# Altium project FC11.PrjPcb
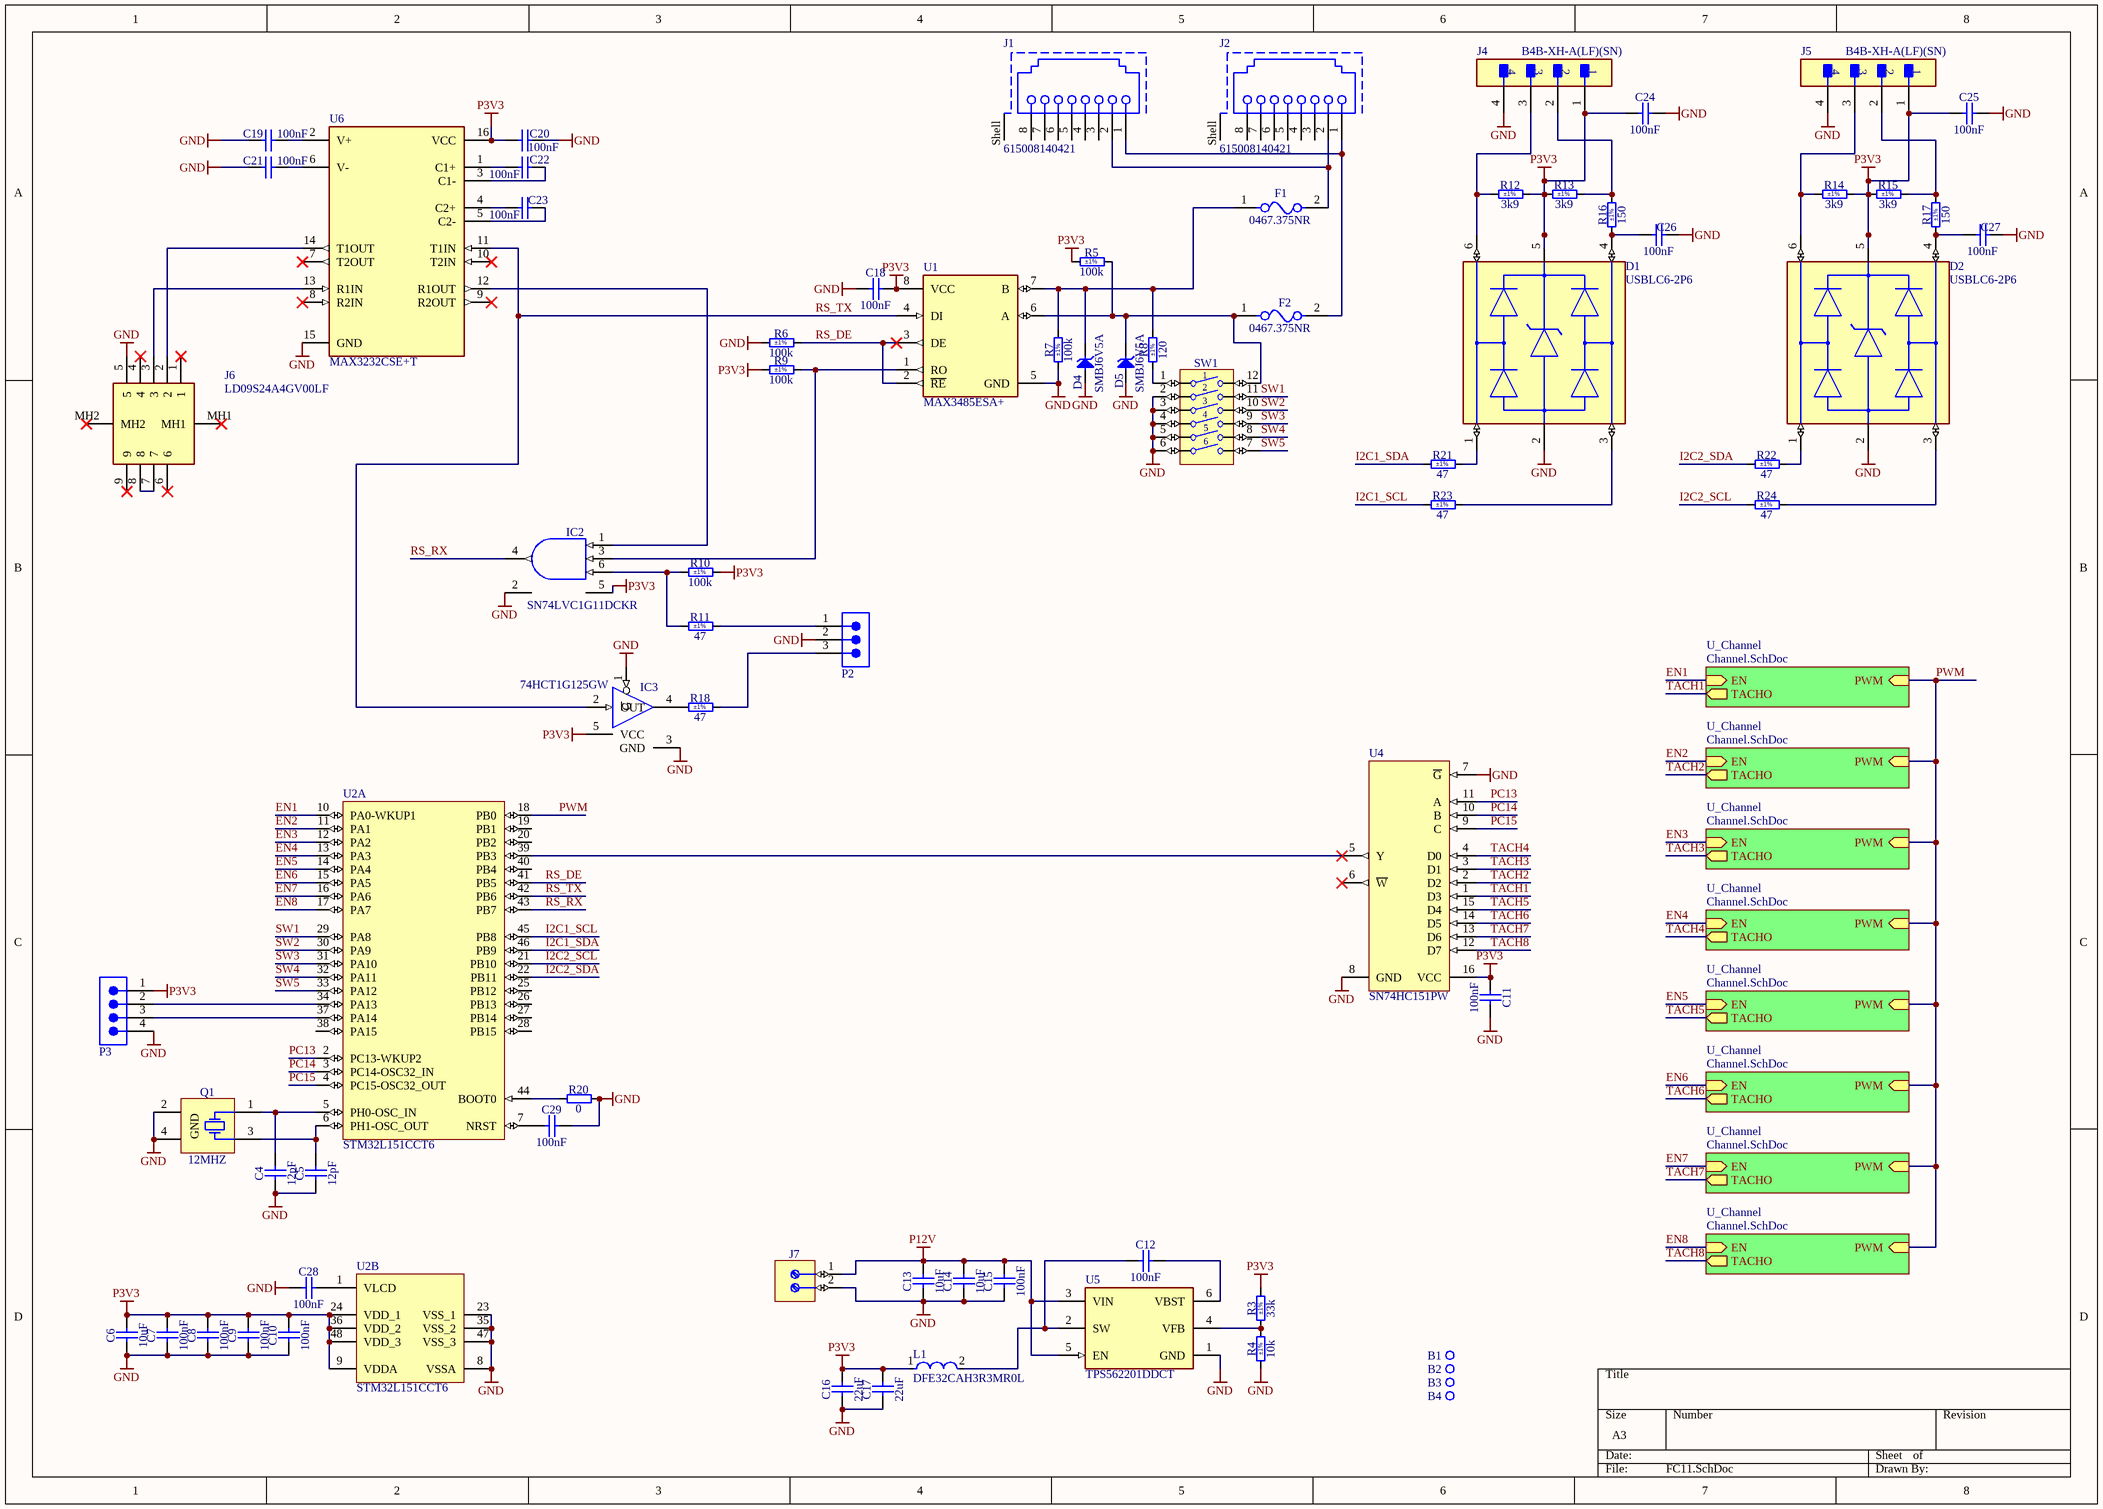
[diagram p0: FC11.SchDoc]
2 sheets, 171 parts. Net scope: hierarchical (ports join the sheet entries above them; power ports are global).
Board file: FC11.PcbDoc
Sheets:
  FC11.SchDoc
    U_Channel = Channel.SchDoc
    U_Channel = Channel.SchDoc
    U_Channel = Channel.SchDoc
    U_Channel = Channel.SchDoc
    U_Channel = Channel.SchDoc
    U_Channel = Channel.SchDoc
    U_Channel = Channel.SchDoc
    U_Channel = Channel.SchDoc

## Sheet FC11.SchDoc
size A3; SheetNumber: 1; SheetTotal: 2

### Parts
B1  Plated Hole  [MTG300_600]  (value not drawn)  (no BOM)
B2  Plated Hole  [MTG300_600]  (value not drawn)  (no BOM)
B3  Plated Hole  [MTG300_600]  (value not drawn)  (no BOM)
B4  Plated Hole  [MTG300_600]  (value not drawn)  (no BOM)
C4  12pF  [CAPC1005X55N]
C5  12pF  [CAPC1005X55N]
C6  10uF  [CAPC2012X95N]
C7  100nF  [CAPC1005X55N]
C8  100nF  [CAPC1005X55N]
C9  100nF  [CAPC1005X55N]
C10  100nF  [CAPC1005X55N]
C11  100nF  [CAPC1005X55N]
C12  100nF  [CAPC1005X55N]
C13  10uF  [CAPC2012X95N]
C14  10uF  [CAPC2012X95N]
C15  100nF  [CAPC1005X55N]
C16  22uF  [CAPC2012X135N]
C17  22uF  [CAPC2012X135N]
C18  100nF  [CAPC1005X55N]
C19  100nF  [CAPC1005X55N]
C20  100nF  [CAPC1005X55N]
C21  100nF  [CAPC1005X55N]
C22  100nF  [CAPC1005X55N]
C23  100nF  [CAPC1005X55N]
C24  100nF  [CAPC1005X55N]
C25  100nF  [CAPC1005X55N]
C26  100nF  [CAPC1005X55N]
C27  100nF  [CAPC1005X55N]
C28  100nF  [CAPC1005X55N]
C29  100nF  [CAPC1005X55N]
D1  USBLC6-2P6  [FP-SOT-666-MFG]
D2  USBLC6-2P6  [FP-SOT-666-MFG]
D4  SMBJ6V5A  [DIOM5336X265N]
D5  SMBJ6V5A  [DIOM5336X265N]
F1  0467.375NR  [FP-467-MFG]
F2  0467.375NR  [FP-467-MFG]
IC2  SN74LVC1G11DCKR  [SOT65P210X110-6N]
IC3  74HCT1G125GW  [SOT65P210X110-5N]
J1  615008140421  [615008140421]
J2  615008140421  [615008140421]
J4  B4B-XH-A(LF)(SN)  [FP-B4B-XH-A_LF_SN-MFG]
J5  B4B-XH-A(LF)(SN)  [FP-B4B-XH-A_LF_SN-MFG]
J6  LD09S24A4GV00LF  [LD09S24A4GV00LF]
J7  (no value)  [PHOENIX_1725656]
L1  DFE32CAH3R3MR0L  [FP-DFE32CAH_R0-MFG]
P2  61300311121  [61300311121]  (value not drawn)
P3  61300411121  [61300411121]  (value not drawn)
Q1  12MHZ  [XTAL_ABRACON_ABM3B]
R3  33k  Tolerance: ±1%  [RESC1005X40N]
R4  10k  Tolerance: ±1%  [RESC1005X40N]
R5  100k  Tolerance: ±1%  [RESC1005X40N]
R6  100k  Tolerance: ±1%  [RESC1005X40N]
R7  100k  Tolerance: ±1%  [RESC1005X40N]
R8  120  Tolerance: ±1%  [RESC1608X55N]
R9  100k  Tolerance: ±1%  [RESC1005X40N]
R10  100k  Tolerance: ±1%  [RESC1005X40N]
R11  47  Tolerance: ±1%  [RESC1005X40N]
R12  3k9  Tolerance: ±1%  [RESC1005X40N]
R13  3k9  Tolerance: ±1%  [RESC1005X40N]
R14  3k9  Tolerance: ±1%  [RESC1005X40N]
R15  3k9  Tolerance: ±1%  [RESC1005X40N]
R16  150  Tolerance: ±1%  [RESC1005X40N]
R17  150  Tolerance: ±1%  [RESC1005X40N]
R18  47  Tolerance: ±1%  [RESC1005X40N]
R20  0  [RESC1005X40N]
R21  47  Tolerance: ±1%  [RESC1005X40N]
R22  47  Tolerance: ±1%  [RESC1005X40N]
R23  47  Tolerance: ±1%  [RESC1005X40N]
R24  47  Tolerance: ±1%  [RESC1005X40N]
SW1  (no value)  [SW_OMRON_A6H-6102]
U1  MAX3485ESA+  [FP-S8-5-MFG]
U2  STM32L151CCT6  [STM-LQFP48_L]  (parts A,B of 2)
U4  SN74HC151PW  [PW0016A_L]
U5  TPS562201DDCT  [FP-DDC0006A-MFG]
U6  MAX3232CSE+T  [FP-S16-1-MFG]

### Sub-sheets
U_Channel = Channel.SchDoc: PWM (in), TACHO (out), EN (in)
U_Channel = Channel.SchDoc: PWM (in), TACHO (out), EN (in)
U_Channel = Channel.SchDoc: PWM (in), TACHO (out), EN (in)
U_Channel = Channel.SchDoc: PWM (in), TACHO (out), EN (in)
U_Channel = Channel.SchDoc: PWM (in), TACHO (out), EN (in)
U_Channel = Channel.SchDoc: PWM (in), TACHO (out), EN (in)
U_Channel = Channel.SchDoc: PWM (in), TACHO (out), EN (in)
U_Channel = Channel.SchDoc: PWM (in), TACHO (out), EN (in)

### Nets
GND: C4.1 C5.1 C6.1 C7.1 C8.1 C9.1 C10.1 C11.1 C13.1 C14.1 C15.1 C16.1 C17.1 C18.1 C19.2 C20.1 C21.2 C24.2 C25.2 C26.2 C27.2 C28.1 C29.2 D1.2(GND) D2.2(GND) D4.2(A) D5.2(A) IC2.2(GND) IC3.1(~{G}) IC3.3(GND) J4.4 J5.4 J6.5 J7.2 P2.2 P3.4 Q1.2(GND) Q1.4(GND) R4.1 R6.1 R7.1 R20.2 SW1.2 SW1.3 SW1.4 SW1.5 SW1.6 U1.5(GND) U2.8(VSSA) U2.23(VSS_1) U2.35(VSS_2) U2.47(VSS_3) U4.7(~{G}) U4.8(GND) U5.1(GND) U6.15(GND)
P3V3: C6.2 C7.2 C8.2 C9.2 C10.2 C11.2 C16.2 C17.2 C18.2 C20.2 C24.1 C25.1 D1.5(VBUS) D2.5(VBUS) IC2.5(VCC) IC3.5(VCC) J4.1 J5.1 L1.1 P3.1 R3.2 R5.1 R9.1 R10.2 R12.2 R13.1 R14.2 R15.1 U1.8(VCC) U2.9(VDDA) U2.24(VDD_1) U2.36(VDD_2) U2.48(VDD_3) U4.16(VCC) U6.16(VCC)
P12V: C13.2 C14.2 C15.2 J7.1 U5.3(VIN) U5.5(EN)
EN1: U2.10(PA0-WKUP1) ; sheet U_Channel/EN
EN2: U2.11(PA1) ; sheet U_Channel/EN
EN3: U2.12(PA2) ; sheet U_Channel/EN
EN4: U2.13(PA3) ; sheet U_Channel/EN
EN5: U2.14(PA4) ; sheet U_Channel/EN
EN6: U2.15(PA5) ; sheet U_Channel/EN
EN7: U2.16(PA6) ; sheet U_Channel/EN
EN8: U2.17(PA7) ; sheet U_Channel/EN
I2C1_SCL: R23.1 U2.45(PB8)
I2C1_SDA: R21.1 U2.46(PB9)
I2C2_SCL: R24.1 U2.21(PB10)
I2C2_SDA: R22.1 U2.22(PB11)
PC13: U2.2(PC13-WKUP2) U4.11(A)
PC14: U2.3(PC14-OSC32_IN) U4.10(B)
PC15: U2.4(PC15-OSC32_OUT) U4.9(C)
PWM: U2.18(PB0) ; sheet U_Channel/PWM, sheet U_Channel/PWM, sheet U_Channel/PWM, sheet U_Channel/PWM, sheet U_Channel/PWM, sheet U_Channel/PWM, sheet U_Channel/PWM, sheet U_Channel/PWM
RS_DE: R6.2 U1.2(~{RE}) U1.3(DE) U2.41(PB5)
RS_RX: IC2.4(Y) U2.43(PB7)
RS_TX: IC3.2(IN) U1.4(DI) U2.42(PB6) U6.11(T1IN)
SW1: SW1.11 U2.29(PA8)
SW2: SW1.10 U2.30(PA9)
SW3: SW1.9 U2.31(PA10)
SW4: SW1.8 U2.32(PA11)
SW5: SW1.7 U2.33(PA12)
TACH1: U4.1(D3) ; sheet U_Channel/TACHO
TACH2: U4.2(D2) ; sheet U_Channel/TACHO
TACH3: U4.3(D1) ; sheet U_Channel/TACHO
TACH4: U4.4(D0) ; sheet U_Channel/TACHO
TACH5: U4.15(D4) ; sheet U_Channel/TACHO
TACH6: U4.14(D5) ; sheet U_Channel/TACHO
TACH7: U4.13(D6) ; sheet U_Channel/TACHO
TACH8: U4.12(D7) ; sheet U_Channel/TACHO
NetC4_2: C4.2 Q1.1(X) U2.5(PH0-OSC_IN)
NetC5_2: C5.2 Q1.3(X) U2.6(PH1-OSC_OUT)
NetC12_1: C12.1 L1.2 U5.2(SW)
NetC12_2: C12.2 U5.6(VBST)
NetC19_1: C19.1 U6.2(V+)
NetC21_1: C21.1 U6.6(V-)
NetC22_1: C22.1 U6.3(C1-)
NetC22_2: C22.2 U6.1(C1+)
NetC23_1: C23.1 U6.5(C2-)
NetC23_2: C23.2 U6.4(C2+)
NetC26_1: C26.1 D1.4(I/O2) R16.1
NetC27_1: C27.1 D2.4(I/O2) R17.1
NetC28_2: C28.2 U2.1(VLCD)
NetC29_1: C29.1 U2.7(NRST)
NetD1_1: D1.1(I/O1) R21.2
NetD1_3: D1.3(I/O2) R23.2
NetD1_6: D1.6(I/O1) J4.3 R12.1
NetD2_1: D2.1(I/O1) R22.2
NetD2_3: D2.3(I/O2) R24.2
NetD2_6: D2.6(I/O1) J5.3 R14.1
NetD4_1: D4.1(C) F1.1 R7.2 R8.2 U1.7(B)
NetD5_1: D5.1(C) F2.1 R5.2 SW1.12 U1.6(A)
NetF1_2: F1.2 J1.2 J2.2
NetF2_2: F2.2 J1.1 J2.1
NetIC2_1: IC2.1(A) U6.12(R1OUT)
NetIC2_3: IC2.3(B) R9.2 U1.1(RO)
NetIC2_6: IC2.6(C) R10.1 R11.1
NetIC3_4: IC3.4(OUT) R18.1
NetJ4_2: J4.2 R13.2 R16.2
NetJ5_2: J5.2 R15.2 R17.2
NetJ6_2: J6.2 U6.14(T1OUT)
NetJ6_3: J6.3 U6.13(R1IN)
NetJ6_7: J6.7 J6.8
NetP2_1: P2.1 R11.2
NetP2_3: P2.3 R18.2
NetP3_2: P3.2 U2.34(PA13)
NetP3_3: P3.3 U2.37(PA14)
NetR3_1: R3.1 R4.2 U5.4(VFB)
NetR8_1: R8.1 SW1.1
NetR20_1: R20.1 U2.44(BOOT0)
NetU2_39: U2.39(PB3) U4.5(Y)

Not connected (* = marked no-connect by the designer): B1 1; B2 1; B3 1; B4 1; J1 3 4 5 6 7 8 Shell; J2 3 4 5 6 7 8 Shell; J6 1* 4* 6* 9* MH1* MH2*; U2 19(PB1) 20(PB2) 25(PB12) 26(PB13) 27(PB14) 28(PB15) 38(PA15) 40(PB4); U4 6(~{W})*; U6 7(T2OUT)* 8(R2IN)* 9(R2OUT)* 10(T2IN)*

### Library data of the parts
B1-B4 = PLATED_HOLE3.0_PAD6.0: Single Terminal Socket; Part Description: Plated Through Hole: Hole Dia.=3.0mm Pad Dia.=6.0mm; Mounted: No; Part Number: PLATED_HOLE3.0_PAD6.0; Component Type: Standard (No BOM); Pin Count: 1; Family: Plated Hole; Socket: No; SMD: No; Sense: No; Status: None; ComponentHeight: 0mm; HelpURL: Undefined; Author: CERN DEM JLC; CreateDate: 26.05.2008; LatestRevisionDate: 26.05.2008; PackageDescription: Plated Through Hole: Hole Dia.=3.0mm Pad Dia.=6.0mm
C4 C5 = CC0402_12PF_50V_5%_C0G: Non-polarised capacitor; Part Description: SMD Multilayer Chip Ceramic Capacitor; Manufacturer: GENERIC; Manufacturer1 Part Number: C0402C120J5GACTU; Voltage: 50V; TC: C0G/NP0; Tolerance: ±5%; Part Number: CC0402_12PF_50V_5%_C0G; Component Kind: Standard; Component Type: Standard; Pin Count: 2; Value: 12pF; Status: Preferred; Manufacturer Part Number: CC0402_12PF_50V_5%_C0G; Case: 0402; Mounted: Yes; Socket: No; SMD: Yes; Sense: No; Manufacturer1 Example: KEMET; Manufacturer1 ComponentHeight: 0.55mm; HelpURL: \\cern.ch\dfs\Applications\Altium\Datasheets\CC0402_C0G_KEMET_(Commercial Grade).pdf; Author: CERN DEM JLC; CreateDate: 04.10.2016; LatestRevisionDate: 04.10.2016
C6 C13 C14 = CC0805_10UF_25V_10%_X5R: Non-polarised capacitor; Part Description: SMD Multilayer Chip Ceramic Capacitor; Manufacturer: GENERIC; Manufacturer1 Part Number: GRM219R61E106KA12D; Voltage: 25V; TC: X5R; Tolerance: ±10%; Part Number: CC0805_10UF_25V_10%_X5R; Component Kind: Standard; Component Type: Standard; Pin Count: 2; Value: 10uF; Status: Preferred; Manufacturer Part Number: CC0805_10UF_25V_10%_X5R; Case: 0805; Mounted: Yes; Socket: No; SMD: Yes; Sense: No; Manufacturer1 Example: MURATA; Manufacturer1 ComponentHeight: 0.95mm; HelpURL: \\cern.ch\dfs\Applications\Altium\Datasheets\CC0805_X5R_MURATA_GRM.pdf; Author: CERN DEM JLC; CreateDate: 25.10.2012; LatestRevisionDate: 06.09.2016
C7-C12 C15 C18-C29 = CC0402_100NF_16V_10%_X5R: Non-polarised capacitor; Part Description: SMD Multilayer Chip Ceramic Capacitor; Manufacturer: GENERIC; Manufacturer1 Part Number: GRM155R61C104KA88D; Voltage: 16V; TC: X5R; Tolerance: ±10%; Part Number: CC0402_100NF_16V_10%_X5R; Component Kind: Standard; Component Type: Standard; Pin Count: 2; Value: 100nF; Status: None; Manufacturer Part Number: CC0402_100NF_16V_10%_X5R; Case: 0402; Mounted: Yes; Socket: No; SMD: Yes; Sense: No; Manufacturer1 Example: MURATA; Manufacturer1 ComponentHeight: 0.55mm; HelpURL: \\cern.ch\dfs\Applications\Altium\Datasheets\CC0402_X5R_MURATA_GRM.pdf; Author: CERN DEM JLC; CreateDate: 10.12.2013; LatestRevisionDate: 10.12.2013
C16 C17 = CC0805_22UF_16V_10%_X5R: Non-polarised capacitor; Part Description: SMD Multilayer Chip Ceramic Capacitor; Manufacturer: GENERIC; Manufacturer1 Part Number: C2012X5R1C226KT; Voltage: 16V; TC: X5R; Tolerance: ±10%; Part Number: CC0805_22UF_16V_10%_X5R; Component Kind: Standard; Component Type: Standard; Pin Count: 2; Value: 22uF; Status: Preferred; Manufacturer Part Number: CC0805_22UF_16V_10%_X5R; Case: 0805; Mounted: Yes; Socket: No; SMD: Yes; Sense: No; Manufacturer1 Example: TDK; Manufacturer1 ComponentHeight: 1.35mm; HelpURL: \\cern.ch\dfs\Applications\Altium\Datasheets\CC0805_X5R_TDK_C.pdf; Author: CERN DEM JLC; CreateDate: 25.10.2012; LatestRevisionDate: 25.10.2012
D1 D2 = CMP-12225-000058-1: TVS DIODE 5.25V 17V SOT666; Min Breakdown Voltage: 6V; Power Line Protection: Yes; Element Configuration: Dual; Test Current: 1mA; Working Voltage: 5V; Number of Channels: 2; Max Reverse Leakage Current: 150nA; Direction: Unidirectional; Peak Pulse Current: 5A; Number of Elements: 1; Capacitance: 3.5pF; Max Breakdown Voltage: 6V; Height: 0.6mm; Depth: 1.3mm; Contact Plating: Tin; Reverse Breakdown Voltage: 6V; REACH SVHC: No SVHC; Operating Supply Voltage: 5V; Width: 1.3mm; Max Operating Temperature: 125°C; Reverse Standoff Voltage: 5V; ESD Protection: Yes; Package Quantity: 1; Termination: SMD/SMT; Length: 1.7mm; Leakage Current: 150nA; Number of Bidirectional Channels: 2; Case/Package: SOT-666; Min Operating Temperature: -40°C; Number of Pins: 6; Clamping Voltage: 17V; Breakdown Voltage: 6V; Lead Free: Lead Free; Radiation Hardening: No; Packaging: Tape and Reel; Mount: Surface Mount; Polarity: Unidirectional
D4 D5 = SMBJ6V5A: Transient Voltage Suppressor Diode (Uni-Directional); Part Description: Uni-Directional Transient Voltage Suppressor Diode; Manufacturer: FAIRCHILD SEMICONDUCTOR; Voltage: 6.5V; Power: 600W; PressFit: No; Bonding: No; Part Number: SMBJ6V5A; Component Kind: Standard; Component Type: Standard; Device: SMBJ6V5A; PackageDescription: DO-214-AA/SMB Diode, Molded Body; 5.34mm L X 3.625mm W X 2.65mm H, IPC Medium Density; Manufacturer Part Number: SMBJ6V5A; Pin Count: 2; Case: DO-214AA; Mounted: Yes; Socket: No; SMD: Yes; Sense: No; ComponentHeight: 2.65mm; HelpURL: \\cern.ch\dfs\Applications\Altium\Datasheets\SMBJ.pdf; Author: CERN DEM MR; CreateDate: 04.09.2017; LatestRevisionDate: 04.09.2017
F1 F2 = CMP-08605-000028-1: FUSE BOARD MOUNT 375MA 32VAC/VDC; Manufacturer: Littelfuse; Fuse Current: 0.375A; Fuse Blow Speed: Fast; Max Fuse Dc Voltage: 32V; Fuse I2T: 0.0035A2Sec; Fuse Interrupt Dc Current: 50A; Octopart: https://octopart.com/0467.375nr-littelfuse-565971; Temperature: -55°C to +90°C; Mouser Description: Surface Mount Fuses 32V.375A VFA Slimline; Automotive: No; Category: Fuse; Temperature Range Low: -55°C; ComponentLink2Description: Datasheet; Max Fuse Ac Voltage: 32V; Lead Free: Yes; Package: 467; Manufacturer Part Number: 0467.375NR; Height: 0.432mm; RoHS: TRUE; ComponentLink2URL: https://www.littelfuse.com/~/media/electronics/datasheets/fuses/littelfuse_fuse_467_datasheet.pdf.pdf; Temperature Range High: +90°C; Device Class L1: Circuit Protection; Voltage Rating: 32V; Device Class L2: Fuses; Fuse Interrupt Ac Current: 50A; Digikey Description: FUSE BOARD MOUNT 375MA 32VAC/VDC; Device Class L3: unset
IC2 = SN74LVC1G11DCKR: Single 3-Input Positive-AND Gate; Manufacturer: TEXAS INSTRUMENTS; PressFit: No; Bonding: No; Part Number: SN74LVC1G11DCKR; Component Kind: Standard; Component Type: Standard; Device: SN74LVC1G11DCKR; PackageDescription: SOT363, SC70-6, 0.65mm Pitch; 6 pin, 1.25mm W X 2.00mm L X 1.10mm H body, IPC Medium Density; Part Description: Single 3-Input Positive-AND Gate; Manufacturer Part Number: SN74LVC1G11DCKR; Pin Count: 6; Case: SOT363; Mounted: Yes; Socket: No; SMD: Yes; Sense: No; ComponentHeight: 1.1mm; Author: CERN DEM JLC; HelpURL: \\cern.ch\dfs\Applications\Altium\Datasheets\SN74LVC1G11DCKR.pdf; CreateDate: 21.07.2014; LatestRevisionDate: 21.07.2014
IC3 = 74HCT1G125GW: Single Bus Buffer Gate With 3-State Output; Part Description: Bus Buffer/Line Driver 3-State; Manufacturer: NEXPERIA; PressFit: No; Bonding: No; Part Number: 74HCT1G125GW; Component Kind: Standard; Component Type: Standard; Device: 74HCT1G125GW; PackageDescription: SOT353, SC70-5, 0.65mm Pitch; 5 Pin, 1.25mm W X 2.00mm L X 1.10mm H body, IPC Medium Density; Manufacturer Part Number: 74HCT1G125GW; Pin Count: 5; Case: SOT353; Mounted: Yes; Socket: No; SMD: Yes; Sense: No; ComponentHeight: 1.1mm; Author: CERN DEM JMW; HelpURL: \\cern.ch\dfs\Applications\Altium\Datasheets\74HCT1G125GW.pdf; CreateDate: 06.08.2020; LatestRevisionDate: 06.08.2020
J1 J2 = CMP-1502-01733-2: NexarPartId: 18818182; Number of Contacts: 8; Voltage Rating (AC): 120V; Current Rating: 1.5A; Gender: Female; Shielding: Shielded; Insulation Resistance: 500MΩ; Number of Ports: 1; Direction: User Selectable; Contact Resistance: 20mΩ; Connector Type: RJ45, Socket; Flammability Rating: UL94 V-0; Orientation: Vertical; Height: 16.65mm; Contact Material: Copper; Width: 19.5mm; Mount: Through Hole; Operating Supply Voltage: 120V; Color: Black; Insulation Material: PBT; Lead Free: Lead Free; Length: 16.65mm; Max Operating Temperature: 85°C; Number of Positions: 8; RoHS: Compliant; Contact Plating: Gold; Number of Rows: 1; REACH SVHC: Unknown; Min Operating Temperature: -40°C; Termination: Through Hole; Housing Material: PBT; Depth: 16.4mm; Voltage Rating: 120V
J4 J5 = CMP-17439-000250-1: CONN HEADER VERT 4POS 2.5MM; Number of Contacts: 4; Contact Resistance: 20mR; Voltage Rating: 250V; Max Current Rating: 3A; Gender: Male; Wire/Cable Gauge: 22AWG; Mated Stacking Heights: 9.8mm; Insulation Resistance: 1GR; Orientation: Straight; Contact Type: Male Pin; Contact Finish - Mating: TIN; Series: XH; Max Voltage Rating (AC): 250V; Lead Pitch: 2.5mm; Contact Shape: Square; Insulation Color: Natural; Termination: Solder; Lead Free: Lead Free; Voltage Rating (AC): 250V; Number of Rows: 1; Flammability Rating: UL94 V-0; Number of Positions: 4; Max Operating Temperature: 85°C; Package Quantity: 500; Mount: Through Hole; REACH SVHC: No SVHC; Connector Type: Header; Insulation Material: Nylon; Fastening Type: Detent; Min Operating Temperature: -25°C; Housing Color: White; Packaging: Bulk; Contact Plating: Tin; Contact Material: Brass; Max Voltage Rating (DC): 250V; Housing Material: Polyamide; Color: Natural; Material: Polyamide; Pitch: 2.5mm; Depth: 5.75mm; Current Rating: 3A; Length: 12.4mm
J6 = LD09S24A4GV00LF: D-Subminiature Economy Range, Input Output Connectors, Signal 9 way Socket Straight, Solder, 50 cycles, Harpoons + Female Screw UNC 4 - 40 + Elec cont., 1.6 mm PCB thickness; Manufacturer_Name: Amphenol Communications Solutions; Geometry.Height: 12.39mm; Manufacturer_Part_Number: LD09S24A4GV00LF; Mouser Part Number: *; Mouser Price/Stock: *; Arrow Part Number: LD09S24A4GV00LF; Arrow Price/Stock: https://www.arrow.com/en/products/ld09s24a4gv00lf/amphenol-fci?region=europe; Datasheet Link: https://cdn.amphenol-cs.com/media/wysiwyg/files/drawing/10130912.pdf
J7 = PHOENIX_1725656: Terminal Block, 2 Positions, Screw Connection; Part Description: 6A, 63V, Terminal Block, Pitch 2.54mm, 2 Positions, Screw Connection; Manufacturer: PHOENIX CONTACT; Manufacturer Part Number: 1725656 (MPT 0,5/2-2,54); PressFit: No; Part Number: PHOENIX_1725656; Component Kind: Standard; Component Type: Standard; Pin Count: 2; Mounted: Yes; Socket: No; SMD: No; Sense: No; Status: None; ComponentHeight: 8.5mm; HelpURL: \\cern.ch\dfs\Applications\Altium\Datasheets\PHOENIX_1725656.pdf; Author: CERN DEM JMW; CreateDate: 07.11.2008; LatestRevisionDate: 26.04.2010
L1 = CMP-00260-130551521-1: DFE32CAH3R3MR0L Inductor Chip Shielded Wirewound 3.3uH 20% 1MHz Metal Alloy 2.3A 1210 Emboss T/R; Inductance: 3.3µH; Series Resistance: 67mΩ; Saturation Current: 4.6A; Test Frequency: 1MHz; Height: 2mm; Composition: Wirewound; Tolerance: 20%; Case/Package: 1210; NexarPartId: 130551521; RMS Current (Irms): 2.3A; Max Operating Temperature: 150°C; Min Operating Temperature: -55°C; Lifecycle Status: Production
P2 = 61300311121: WR-PHD Pin Header, THT, Vertical, pitch 2.54mm, 1 Row, 3P; Manufacturer: Wurth Elektronik; Contact Resistance: 20mΩ; Rated Current: 3A; Working Voltage: 250V; Withstanding Voltage: 500V; ComponentLink1Description: Website Link; ComponentLink1URL: https://www.we-online.com/redexpert/article/61300311121?ad; ComponentLink2Description: Datasheet Link; ComponentLink2URL: https://www.we-online.com/redexpert/spec/61300311121?ad; Manufacturer Part Number: 61300311121; Category: Board-to-Board Connectors; Match Code: WR-PHD; Mount: Through Hole; Operating Temperature Max: 105°C; Operating Temperature Min: -40°C; Packaging: Bag; Gender: Pin Header; Number of Pins: 3; Number of Rows: 1; Orientation: Vertical; Pitch: 2.54mm
P3 = 61300411121: WR-PHD Pin Header, THT, Vertical, pitch 2.54mm, 1 Row, 4P; Manufacturer: Wurth Elektronik; Contact Resistance: 20mΩ; Rated Current: 3A; Working Voltage: 250V; Withstanding Voltage: 500V; ComponentLink1Description: Website Link; ComponentLink1URL: https://www.we-online.com/redexpert/article/61300411121?ad; ComponentLink2Description: Datasheet Link; ComponentLink2URL: https://www.we-online.com/redexpert/spec/61300411121?ad; Manufacturer Part Number: 61300411121; Category: Board-to-Board Connectors; Match Code: WR-PHD; Mount: Through Hole; Operating Temperature Max: 105°C; Operating Temperature Min: -40°C; Packaging: Bag; Gender: Pin Header; Number of Pins: 4; Number of Rows: 1; Orientation: Vertical; Pitch: 2.54mm
Q1 = XTAL_12MHZ_ABRACON_ABM3B-12.000MHZ-B2-T: Crystal 4 pins 1=XTAL Control 2=GND3=XTAL 4=GND; Part Description: Tolerance:± 20ppm, Stability:± 50ppm, -20°C to +70°C, 18pF, Ceramic SMD Crystal, ABM3B Series; PressFit: No; Bonding: No; Part Number: XTAL_12MHZ_ABRACON_ABM3B-12.000MHZ-B2-T; Component Kind: Standard; Component Type: Standard; PackageDescription: ABM3B Serie, SMD Crystal, Body 5x3.2mm; Value: 12MHZ; Manufacturer: ABRACON; Manufacturer Part Number: ABM3B-12.000MHZ-B2-T; Pin Count: 2; Mounted: Yes; Socket: No; SMD: Yes; Sense: No; ComponentHeight: 1.1mm; HelpURL: \\cern.ch\dfs\Applications\Altium\Datasheets\XTAL_ABRACON_ABM3B.pdf; Author: CERN DEM JLC; CreateDate: 06.03.2012; LatestRevisionDate: 06.03.2012
R3 = R0402_33K_1%_0.0625W_100PPM: Resistor - 1%; Part Description: General Purpose Thick Film Chip Resistor; Manufacturer: GENERIC; Manufacturer1 Part Number: 232270673303L; TC: ±100ppm/°C; PressFit: No; Part Number: R0402_33K_1%_0.0625W_100PPM; Component Kind: Standard; Component Type: Standard; Pin Count: 2; Value: 33k; Status: Not Recommended; Power: 0.0625W; Manufacturer Part Number: R0402_33K_1%_0.0625W_100PPM; Case: 0402; Mounted: Yes; Sense: No; Socket: No; SMD: Yes; Manufacturer1 Example: YAGEO PHYCOMP; Manufacturer1 ComponentHeight: 0.4mm; HelpURL: \\cern.ch\dfs\Applications\Altium\Datasheets\R0402_Phycomp_RC0402.pdf; Author: CERN DEM JLC; CreateDate: 03.12.2007; LatestRevisionDate: 17.10.2012
R4 = R0402_10K_1%_0.0625W_100PPM: Resistor - 1%; Part Description: General Purpose Thick Film Chip Resistor; Manufacturer: GENERIC; Manufacturer1 Part Number: 232270671003L; TC: ±100ppm/°C; PressFit: No; Part Number: R0402_10K_1%_0.0625W_100PPM; Component Kind: Standard; Component Type: Standard; Pin Count: 2; Value: 10k; Status: Not Recommended; Power: 0.0625W; Manufacturer Part Number: R0402_10K_1%_0.0625W_100PPM; Case: 0402; Mounted: Yes; Sense: No; Socket: No; SMD: Yes; Manufacturer1 Example: YAGEO PHYCOMP; Manufacturer1 ComponentHeight: 0.4mm; HelpURL: \\cern.ch\dfs\Applications\Altium\Datasheets\R0402_Phycomp_RC0402.pdf; Author: CERN DEM JLC; CreateDate: 03.12.2007; LatestRevisionDate: 17.10.2012
R5-R7 R9 R10 = R0402_100K_1%_0.0625W_100PPM: Resistor - 1%; Part Description: General Purpose Thick Film Chip Resistor; Manufacturer: GENERIC; Manufacturer1 Part Number: 232270671004L; TC: ±100ppm/°C; PressFit: No; Part Number: R0402_100K_1%_0.0625W_100PPM; Component Kind: Standard; Component Type: Standard; Pin Count: 2; Value: 100k; Status: Not Recommended; Power: 0.0625W; Manufacturer Part Number: R0402_100K_1%_0.0625W_100PPM; Case: 0402; Mounted: Yes; Sense: No; Socket: No; SMD: Yes; Manufacturer1 Example: YAGEO PHYCOMP; Manufacturer1 ComponentHeight: 0.4mm; HelpURL: \\cern.ch\dfs\Applications\Altium\Datasheets\R0402_Phycomp_RC0402.pdf; Author: CERN DEM JLC; CreateDate: 03.12.2007; LatestRevisionDate: 17.10.2012
R8 = R0603_120R_1%_0.1W_100PPM: Resistor - 1%; Part Description: General Purpose Thick Film Chip Resistor; Manufacturer: GENERIC; Manufacturer1 Part Number: NRC06F1200TRF; Power: 0.1W; TC: ±100ppm/°C; PressFit: No; Part Number: R0603_120R_1%_0.1W_100PPM; Component Kind: Standard; Component Type: Standard; Pin Count: 2; Value: 120; Status: Preferred; Manufacturer Part Number: R0603_120R_1%_0.1W_100PPM; Case: 0603; Mounted: Yes; Sense: No; Socket: No; SMD: Yes; Manufacturer1 Example: NIC COMPONENT; Manufacturer1 ComponentHeight: 0.55mm; HelpURL: \\cern.ch\dfs\Applications\Altium\Datasheets\R0603_NIC_NRC.pdf; Author: CERN DEM JLC; CreateDate: 03.12.2007; LatestRevisionDate: 13.03.2008
R11 R18 R21-R24 = R0402_47R_1%_0.0625W_100PPM: Resistor - 1%; Part Description: General Purpose Thick Film Chip Resistor; Manufacturer: GENERIC; Manufacturer1 Part Number: 232270674709L; TC: ±100ppm/°C; PressFit: No; Part Number: R0402_47R_1%_0.0625W_100PPM; Component Kind: Standard; Component Type: Standard; Pin Count: 2; Value: 47; Status: Not Recommended; Power: 0.0625W; Manufacturer Part Number: R0402_47R_1%_0.0625W_100PPM; Case: 0402; Mounted: Yes; Sense: No; Socket: No; SMD: Yes; Manufacturer1 Example: YAGEO PHYCOMP; Manufacturer1 ComponentHeight: 0.4mm; HelpURL: \\cern.ch\dfs\Applications\Altium\Datasheets\R0402_Phycomp_RC0402.pdf; Author: CERN DEM JLC; CreateDate: 03.12.2007; LatestRevisionDate: 17.10.2012
R12-R15 = R0402_3K9_1%_0.0625W_100PPM: Resistor - 1%; Part Description: General Purpose Thick Film Chip Resistor; Manufacturer: GENERIC; Manufacturer1 Part Number: 232270673902L; TC: ±100ppm/°C; PressFit: No; Part Number: R0402_3K9_1%_0.0625W_100PPM; Component Kind: Standard; Component Type: Standard; Pin Count: 2; Value: 3k9; Status: Not Recommended; Power: 0.0625W; Manufacturer Part Number: R0402_3K9_1%_0.0625W_100PPM; Case: 0402; Mounted: Yes; Sense: No; Socket: No; SMD: Yes; Manufacturer1 Example: YAGEO PHYCOMP; Manufacturer1 ComponentHeight: 0.4mm; HelpURL: \\cern.ch\dfs\Applications\Altium\Datasheets\R0402_Phycomp_RC0402.pdf; Author: CERN DEM JLC; CreateDate: 03.12.2007; LatestRevisionDate: 17.10.2012
R16 R17 = R0402_150R_1%_0.0625W_100PPM: Resistor - 1%; Part Description: General Purpose Thick Film Chip Resistor; Manufacturer: GENERIC; Manufacturer1 Part Number: 232270671501L; TC: ±100ppm/°C; PressFit: No; Part Number: R0402_150R_1%_0.0625W_100PPM; Component Kind: Standard; Component Type: Standard; Pin Count: 2; Value: 150; Status: Not Recommended; Power: 0.0625W; Manufacturer Part Number: R0402_150R_1%_0.0625W_100PPM; Case: 0402; Mounted: Yes; Sense: No; Socket: No; SMD: Yes; Manufacturer1 Example: YAGEO PHYCOMP; Manufacturer1 ComponentHeight: 0.4mm; HelpURL: \\cern.ch\dfs\Applications\Altium\Datasheets\R0402_Phycomp_RC0402.pdf; Author: CERN DEM JLC; CreateDate: 03.12.2007; LatestRevisionDate: 17.10.2012
R20 = R0402_0R_JUMPER: Resistor; Part Description: 1A (0.05R Max DC Resistance) Zero Ohm Jumper; Manufacturer: GENERIC; Manufacturer1 Part Number: 232270591001L; PressFit: No; Part Number: R0402_0R_JUMPER; Component Kind: Standard; Component Type: Standard; Pin Count: 2; Value: 0; Status: Not Recommended; Manufacturer Part Number: R0402_0R_JUMPER; Case: 0402; Mounted: Yes; Sense: No; Socket: No; SMD: Yes; Manufacturer1 Example: YAGEO PHYCOMP; Manufacturer1 ComponentHeight: 0.4mm; HelpURL: \\cern.ch\dfs\Applications\Altium\Datasheets\R0402_Phycomp_RC0402.pdf; Author: CERN DEM JLC; CreateDate: 03.12.2007; LatestRevisionDate: 17.10.2012
SW1 = SW_OMRON_A6H-6102: 6 Ways SPST DIP Switch; Part Description: 6 Ways Ultra-low Profile, Half-pitch, SPST DIP Switch With Seal Tape, Rating 25mA 24VDC; Manufacturer: OMRON; PressFit: No; Part Number: SW_OMRON_A6H-6102; Component Kind: Standard; Component Type: Standard; Pin Count: 12; PackageDescription: Pitch 1.27mm, Body 8.85 x 4.5mm, 6 Ways SPST Surface-Mounting DIP Switch, OMRON A6H; Family: Switch; Mounted: Yes; Socket: No; SMD: Yes; Sense: No; Status: None; Manufacturer Part Number: A6H-6102; ComponentHeight: 1.45mm; HelpURL: \\cern.ch\dfs\Applications\Altium\Datasheets\SW_OMRON_A6H-6102.pdf; Author: CERN DEM JLC; CreateDate: 01.02.2018; LatestRevisionDate: 01.02.2018
U1 = CMP-05679-000020-1: IC TXRX RS485/422 10MBPS 8SOIC; Manufacturer: Maxim Integrated; Nominal Supply Current: 0.95-1.1mA; Data Rate: 10Mbits/s; Min Supply Voltage: 3V; Interface: RS-485,RS-422; Number Of Transmitters: 1; Max Supply Voltage: 3.6V; Max Junction Temp: +160°C; Standoff Height: 0.1mm; Simplex Duplex: Half Duplex; Height: 1.75mm; Temperature Range High: +85°C; Device Class L2: Interface ICs; Digikey Description: IC TXRX RS485/422 10MBPS 8SOIC; Temperature: -40°C to +85°C; Device Class L3: RS-232 / RS-422 / RS-485 Interface ICs; Temperature Range Low: -40°C; Footprint Url: https://pdfserv.maximintegrated.com/land_patterns/90-0096.PDF; Category: IC; ComponentLink2URL: https://datasheets.maximintegrated.com/en/ds/MAX3483-MAX3491.pdf; Package: S8-5; Octopart: https://octopart.com/max3485esa%2B-maxim+integrated-39731860; RoHS: TRUE; Manufacturer Part Number: MAX3485ESA+; Lead Free: Yes; ComponentLink2Description: Datasheet; Device Class L1: Integrated Circuits (ICs); Mouser Description: 3.3V Powered, 10Mbps and Slew-Rate Limited, True RS-485/RS-422 Transceivers; Number Of Receivers: 1; Automotive: No
U2 = CMP-0236-00052-2: ARM Cortex-M3 32-bit MCU, 256 KB Flash, 32 KB Internal RAM, 37 I/Os, 48-pin LQFP, -40 to 85 degC, Tray; Operating Frequency(F) (Processor speed) (MHz): 32; Supply Voltage(Vcc) min (V): 1.65; D/A Converter: 2x12-bit (2 Channel); Data E2PROM nom (B): 8192; I/Os (High Current): 37; FLASH Size (Prog) (kB): 256; ComponentLink3URL: http://www.st.com/st-web-ui/static/active/en/resource/technical/document/datasheet/DM00058181.pdf; PackageDescription: 48-Pin Low Profile Quad Flat Package, 7 x 7 mm Body, 0.5 mm Pitch; Core: ARM Cortex-M3; ComponentLink1Description: Manufacturer URL; ComponentLink1URL: http://www.st.com/web/en/home.html; PartNumber: STM32L151CCT6; PackageVersion: Rev. 6, 06/2013; ComponentLink2URL: http://www.st.com/st-web-ui/static/active/en/resource/technical/document/datasheet/DM00048356.pdf; Internal RAM Size (kB): 32; DatasheetVersion: Rev. 3; PackageReference: LQFP48; ComponentLink3Description: Package Specification; ComponentLink2Description: Datasheet; Mounting Technology: Surface Mount; Packing: Tray
U4 = CMP-1633-00864-2: 8-Line To 1-Line Data Selectors/Multiplexers, PW0016A, TUBE; Manufacturer: Texas Instruments; Configuration: 8：1; VCC(Min)(V): 2; Rating: Catalog; Input Type: LVTTL/CMOS; Function: Encoder/Multiplexer; F @ Nom Voltage(Max)(Mhz): 28; tpd @ Nom Voltage(Max)(ns): 63; Schmitt Trigger: No; VCC(Max)(V): 6; Voltage(Nom)(V): 3.3,5; Output Drive (IOL/IOH)(Max)(mA): 7.8/-7.8; Output Type: CMOS; Technology Family: HC; ICC @ Nom Voltage(Max)(mA): 0.08; Channels(#): 1; Bits(#): 8; Type: Standard; PackageReference: PW0016A; Code_JEDEC: MO-153; DatasheetVersion: SCLS110E; Generic Part Number: SN74HC151; Operating Temperature Range(C): -40 to 85
U5 = CMP-04918-000010-1: IC REG BUCK ADJ 2A TSOT23-6; Manufacturer: Texas Instruments; Min Supply Voltage: 4.5V; Nominal Supply Current: 380uA; Output Type: AdjustableProgrammable; Standoff Height: 0mm; Max Supply Voltage: 17V; Output Voltage: 0.76-7V; Max Duty Cycle: 80%; Switching Frequency: 580kHz; Number Of Outputs: 1; Max Junction Temp: +125°C; Temperature Range Low: -40°C; Device Class L2: Power Management ICs; Package: DDC0006A; Switching Topology: Buck; Manufacturer Part Number: TPS562201DDCT; Category: IC; RoHS: TRUE; Digikey Description: IC REG BUCK ADJ 2A TSOT23-6; Height: 1.1mm; Temperature: -40°C to +125°C; Temperature Range High: +125°C; Octopart: https://octopart.com/tps562201ddct-texas+instruments-68059584; Lead Free: Yes; ComponentLink2URL: http://www.ti.com/lit/ds/symlink/tps562201.pdf; Device Class L3: Voltage Regulators - Switching; Device Class L1: Integrated Circuits (ICs); Output Current: 2A; ComponentLink2Description: Datasheet; Mouser Description: Conv DC-DC 4.5V to 17V Synchronous Step Down Single-Out 0.76V to 7V 2A 6-Pin TSOT-23 T/R; Automotive: No
U6 = CMP-2000-06662-2: IC TXRX RS-232 LP 16SOIC; Manufacturer: Maxim Integrated; Nominal Supply Current: 0.3mA; Max Supply Voltage: 5.5V; Number Of Transmitters: 2; Simplex Duplex: Full Duplex; Min Supply Voltage: 3V; Data Rate: 235kbits/s; Standoff Height: 0.1mm; ComponentLink2URL: https://www.maximintegrated.com/en/ds/MAX3222-MAX3241.pdf; Device Class L2: Interface ICs; Interface: RS-232; RoHS: TRUE; Octopart: https://octopart.com/max3232cse%2Bt-maxim+integrated-39731899; Category: IC; Device Class L3: RS-232 / RS-422 / RS-485 Interface ICs; Automotive: No; Mouser Description: RS-232 Interface IC 3-5.5V 235kbps Transceiver; Temperature Range High: +70°C; Manufacturer Part Number: MAX3232CSE+T; Number Of Receivers: 2; Digikey Description: IC TXRX RS-232 LP 16SOIC; ComponentLink2Description: Datasheet; Temperature Range Low: 0°C; Footprint Url: https://pdfserv.maximintegrated.com/land_patterns/90-0097.PDF; Device Class L1: Integrated Circuits (ICs); Ipc Land Pattern Name: SOIC127P600X155-16; Lead Free: Yes; Package: S16-1; Height: 1.75mm; Temperature: 0°C to +70°C

## Sheet Channel.SchDoc
size A4; SheetNumber: 2; SheetTotal: 2
Used 8 times, as channels U_Channel, U_Channel, U_Channel, U_Channel, U_Channel, U_Channel, U_Channel, U_Channel. Parts and nets are listed once, with the designators drawn on the sheet.
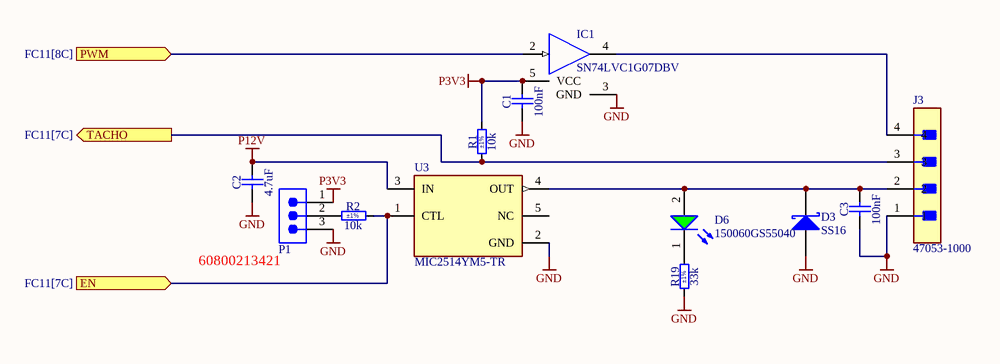
[diagram p1: Channel.SchDoc]

### Parts
C1  100nF  [CAPC1005X55N]
C2  4.7uF  [CAPC1709X95N]
C3  100nF  [CAPC1005X55N]
D3  SS16  [FAIR-SMA-2_B_V]
D6  150060GS55040  [WL-SMCD_0603]
IC1  SN74LVC1G07DBV  [SOT95P280X145-5N]
J3  47053-1000  [FP-470531000-MFG]
P1  (no value)  [62000311121]
R1  10k  Tolerance: ±1%  [RESC1005X40N]
R2  10k  Tolerance: ±1%  [RESC1005X40N]
R19  33k  Tolerance: ±1%  [RESC1005X40N]
U3  MIC2514YM5-TR  [FP-SOT23-5LD-PL-1-IPC_A]

### Ports
EN (in, see FC11[7C]), PWM (in, see FC11[8C]), TACHO (out, see FC11[7C])

### Nets
GND: C1.1 C2.1 C3.1 D3.1(A) IC1.3(GND) J3.1 P1.3 R19.1 U3.2(GND)
P3V3: C1.2 IC1.5(VCC) P1.1 R1.2  [also labelled VDD]
P12V: C2.2 U3.3(IN)
EN: R2.2 U3.1(CTL) ; port EN
PWM: IC1.2(IN) ; port PWM
TACHO: J3.3 R1.1 ; port TACHO
NetC3_2: C3.2 D3.2(K) D6.2(A) J3.2 U3.4(OUT)
NetD6_1: D6.1(K) R19.2
NetIC1_4: IC1.4(OUT) J3.4
NetP1_2: P1.2 R2.1

Not connected (* = marked no-connect by the designer): U3 5(NC)

### Channels
U_Channel: designators end in A; ports EN=EN1 PWM=PWM TACHO=TACH1
U_Channel: designators end in B; ports EN=EN2 PWM=PWM TACHO=TACH2
U_Channel: designators end in C; ports EN=EN3 PWM=PWM TACHO=TACH3
U_Channel: designators end in D; ports EN=EN4 PWM=PWM TACHO=TACH4
U_Channel: designators end in E; ports EN=EN5 PWM=PWM TACHO=TACH5
U_Channel: designators end in F; ports EN=EN6 PWM=PWM TACHO=TACH6
U_Channel: designators end in G; ports EN=EN7 PWM=PWM TACHO=TACH7
U_Channel: designators end in H; ports EN=EN8 PWM=PWM TACHO=TACH8

### Notes on the sheet
- (near P1) 60800213421

### Library data of the parts
C1 C3 = CC0402_100NF_16V_10%_X5R: as C7 on sheet FC11; Part Number: CC0402_100NF_16V_10%_X5R; Component Kind: Standard; Component Type: Standard; Pin Count: 2; Value: 100nF; Status: None; Manufacturer Part Number: CC0402_100NF_16V_10%_X5R; Case: 0402; Mounted: Yes; Socket: No; SMD: Yes; Sense: No; Manufacturer1 Example: MURATA; Manufacturer1 ComponentHeight: 0.55mm; HelpURL: \\cern.ch\dfs\Applications\Altium\Datasheets\CC0402_X5R_MURATA_GRM.pdf; Author: CERN DEM JLC; CreateDate: 10.12.2013; LatestRevisionDate: 10.12.2013
C2 = CC0603_4.7UF_16V_10%_X5R: Non-polarised capacitor; Part Description: SMD Multilayer Chip Ceramic Capacitor; Manufacturer: GENERIC; Manufacturer1 Part Number: EMK107ABJ475KA-T; Voltage: 16V; TC: X5R; Tolerance: ±10%; Part Number: CC0603_4.7UF_16V_10%_X5R; Component Kind: Standard; Component Type: Standard; Pin Count: 2; Value: 4.7uF; Status: None; Manufacturer Part Number: CC0603_4.7UF_16V_10%_X5R; Case: 0603; Mounted: Yes; Socket: No; SMD: Yes; Sense: No; Manufacturer1 Example: TAIYO YUDEN; Manufacturer1 ComponentHeight: 0.95mm; HelpURL: \\cern.ch\dfs\Applications\Altium\Datasheets\CC0603_X7R_TAIYO-YUDEN_HIGH-VALUE.pdf; Author: CERN DEM JLC; CreateDate: 16.12.2013; LatestRevisionDate: 16.09.2014
D3 = CMP-2000-07149-1: Schottky Rectifier, 700 mV, -65 to 125 degC, 2-Pin SMA, RoHS, Tape and Reel; Manufacturer: FairchildSemiconductor; Type: SchottkyDiode; Peak Average Forward Current: 1@Ta=75CA; Peak Reverse Current: 200uA; Peak Non-Repetitive Surge Current: 40A; Configuration: Single; Peak Forward Voltage: 0.7V; Peak Reverse Repetitive Voltage: 60V; Package: 2DO-214AC; Datasheet URL: http://www.mouser.com/ds/2/149/SS16-196707.pdf; Package Description: 2-Pin Surface Mount Device, Body 4.375 x 2.725 mm; Packaging: Tape&Reel; Package Reference: SMA-2; Mounting: SurfaceMount; Operating Temperature: -65to125°C; Datasheet Version: Rev. 1.9, 01/2015; Mounting Technology: SurfaceMount; Category: Rectifier; Manufacturer URL: https://www.fairchildsemi.com/
D6 = CMP-03913-90235563-2: 150060GS55040 WL-SMCD SMT Mono-color Chip LED Diffused; Forward Voltage: 3.2V; Forward Current: 60mA; Luminous Intensity: 430mcd; Peak Wavelength: 520nm; Viewing Angle: 140°; Wavelength: 525nm; Max Reverse Voltage (DC): 5V; Max Operating Temperature: 85°C; Length: 1.6mm; Height: 400µm; Packaging: Tape and Reel; NexarPartId: 90235563; Dominant Wavelength: 525nm; Min Operating Temperature: -40°C; RoHS: Compliant; Width: 800µm
IC1 = SN74LVC1G07DBV: Single Buffer/Driver With Open-Drain Output; Manufacturer: TEXAS INSTRUMENTS; PressFit: No; Bonding: No; Part Number: SN74LVC1G07DBV; Component Kind: Standard; Component Type: Standard; Device: SN74LVC1G07DBV; PackageDescription: SOT, 0.95mm Pitch; 5 Pin, 1.60mm W X 2.90mm L X 1.45mm H body, IPC Medium Density; Part Description: Single Buffer/Driver With Open-Drain Output; Manufacturer Part Number: SN74LVC1G07DBV; Pin Count: 5; Case: SOT23-5; Mounted: Yes; Socket: No; SMD: Yes; Sense: No; ComponentHeight: 1.45mm; Author: CERN DEM BC; HelpURL: \\cern.ch\dfs\Applications\Altium\Datasheets\SN74LVC1G07DBV.pdf; CreateDate: 19.02.2020; LatestRevisionDate: 19.02.2020
J3 = CMP-04776-000290-2: CONN HEADER VERT 4POS 2.54MM; NexarPartId: 854935; Manufacturer Lifecycle Status: ACTIVE; Voltage Rating (DC): 250V; Gender: Male; Plating: Copper; Number of Positions: 4; Glow Wire Compliant: Non-compliant; Current Rating: 500mA; Max Operating Temperature: 75°C; Number of Rows: 1; REACH SVHC: Unknown; Ambient Temperature Range High: 105°C; Pitch: 2.54mm; Height: 7.7mm; Min Operating Temperature: 0°C; Packaging: Bulk; Contact Material: Brass, Copper; Contact Plating: Tin; Lead Pitch: 2.54mm; Voltage Rating: 250V; Termination: Through Hole; Radiation Hardening: No; Orientation: Vertical; Mount: Through Hole; Number of Pins: 4; Country of Origin: HK; Halogen Free: Low Halogen; Lifecycle Status: Production; Number of Circuits: 4; Schedule B: 8536694040, 8536694040; Housing Color: Beige; Housing Material: Nylon; Depth: 5.84mm; RoHS: Compliant; Length: 10.2mm; Number of Contacts: 4
P1 = 62000311121: WR-PHD Pin Header, THT, Vertical, pitch 2mm, 1 Row, 3P; Manufacturer: Wurth Elektronik; Contact Resistance: 20mΩ; Rated Current: 2A; Working Voltage: 200V; Withstanding Voltage: 500V; ComponentLink1Description: Website Link; ComponentLink1URL: https://www.we-online.com/redexpert/article/62000311121?ad; ComponentLink2Description: Datasheet Link; ComponentLink2URL: https://www.we-online.com/redexpert/spec/62000311121?ad; Manufacturer Part Number: 62000311121; Category: Board-to-Board Connectors; Match Code: WR-PHD; Mount: Through Hole; Operating Temperature Max: 105°C; Operating Temperature Min: -40°C; Packaging: Bag; Gender: Pin Header; Number of Pins: 3; Number of Rows: 1; Orientation: Vertical; Pitch: 2mm
R1 R2 = R0402_10K_1%_0.0625W_100PPM: as R4 on sheet FC11; Part Number: R0402_10K_1%_0.0625W_100PPM; Component Kind: Standard; Component Type: Standard; Pin Count: 2; Value: 10k; Status: Not Recommended; Power: 0.0625W; Manufacturer Part Number: R0402_10K_1%_0.0625W_100PPM; Case: 0402; Mounted: Yes; Sense: No; Socket: No; SMD: Yes; Manufacturer1 Example: YAGEO PHYCOMP; Manufacturer1 ComponentHeight: 0.4mm; HelpURL: \\cern.ch\dfs\Applications\Altium\Datasheets\R0402_Phycomp_RC0402.pdf; Author: CERN DEM JLC; CreateDate: 03.12.2007; LatestRevisionDate: 17.10.2012
R19 = R0402_33K_1%_0.0625W_100PPM: as R3 on sheet FC11; Part Number: R0402_33K_1%_0.0625W_100PPM; Component Kind: Standard; Component Type: Standard; Pin Count: 2; Value: 33k; Status: Not Recommended; Power: 0.0625W; Manufacturer Part Number: R0402_33K_1%_0.0625W_100PPM; Case: 0402; Mounted: Yes; Sense: No; Socket: No; SMD: Yes; Manufacturer1 Example: YAGEO PHYCOMP; Manufacturer1 ComponentHeight: 0.4mm; HelpURL: \\cern.ch\dfs\Applications\Altium\Datasheets\R0402_Phycomp_RC0402.pdf; Author: CERN DEM JLC; CreateDate: 03.12.2007; LatestRevisionDate: 17.10.2012
U3 = CMP-06317-000031-1: IC PWR SWITCH P-CHAN 1:1 SOT23-5; Current Rating: 2.5A; Min Input Voltage: 0V; On-state Resistance-Max: 2.4R; Max Output Current: 1.2A; Max Supply Voltage: 13.5V; Nominal Supply Current: 95uA; Output Configuration: High Side; Max Input Voltage: 800mV; Number of Inputs: 1; Fault Protection: Over Temperature; On-State Resistance: 950mR; Min Supply Voltage: 3V; Interface: On/Off; Min Operating Temperature: -40°C; Series: IttyBitty®; RoHS Compliant: Yes; Packaging: Tape and Reel; Radiation Hardening: No; Case/Package: SOT-23; Width: 1.6mm; REACH SVHC: No SVHC; Number of Pins: 5; Supply Current: 95uA; Mount: Surface Mount; Max Operating Temperature: 85°C; Height: 1.1mm; Lead Free: Lead Free; Length: 2.9mm; Number of Outputs: 1; Package Quantity: 3000; Rated Current-Max: 2.5A

## Nets that join several sheets
GND: FC11 (56 pins), U_Channel (9 pins), U_Channel (9 pins), U_Channel (9 pins), U_Channel (9 pins), U_Channel (9 pins), U_Channel (9 pins), U_Channel (9 pins), U_Channel (9 pins)
P3V3: FC11 (35 pins), U_Channel (C1A.2 IC1A.5 P1A.1 R1A.2), U_Channel (C1B.2 IC1B.5 P1B.1 R1B.2), U_Channel (C1C.2 IC1C.5 P1C.1 R1C.2), U_Channel (C1D.2 IC1D.5 P1D.1 R1D.2), U_Channel (C1E.2 IC1E.5 P1E.1 R1E.2), U_Channel (C1F.2 IC1F.5 P1F.1 R1F.2), U_Channel (C1G.2 IC1G.5 P1G.1 R1G.2), U_Channel (C1H.2 IC1H.5 P1H.1 R1H.2)
P12V: FC11 (6 pins), U_Channel (C2A.2 U3A.3), U_Channel (C2B.2 U3B.3), U_Channel (C2C.2 U3C.3), U_Channel (C2D.2 U3D.3), U_Channel (C2E.2 U3E.3), U_Channel (C2F.2 U3F.3), U_Channel (C2G.2 U3G.3), U_Channel (C2H.2 U3H.3)
EN1: FC11 (U2.10), U_Channel (R2A.2 U3A.1)
EN2: FC11 (U2.11), U_Channel (R2B.2 U3B.1)
EN3: FC11 (U2.12), U_Channel (R2C.2 U3C.1)
EN4: FC11 (U2.13), U_Channel (R2D.2 U3D.1)
EN5: FC11 (U2.14), U_Channel (R2E.2 U3E.1)
EN6: FC11 (U2.15), U_Channel (R2F.2 U3F.1)
EN7: FC11 (U2.16), U_Channel (R2G.2 U3G.1)
EN8: FC11 (U2.17), U_Channel (R2H.2 U3H.1)
PWM: FC11 (U2.18), U_Channel (IC1A.2), U_Channel (IC1B.2), U_Channel (IC1C.2), U_Channel (IC1D.2), U_Channel (IC1E.2), U_Channel (IC1F.2), U_Channel (IC1G.2), U_Channel (IC1H.2)
TACH1: FC11 (U4.1), U_Channel (J3A.3 R1A.1)
TACH2: FC11 (U4.2), U_Channel (J3B.3 R1B.1)
TACH3: FC11 (U4.3), U_Channel (J3C.3 R1C.1)
TACH4: FC11 (U4.4), U_Channel (J3D.3 R1D.1)
TACH5: FC11 (U4.15), U_Channel (J3E.3 R1E.1)
TACH6: FC11 (U4.14), U_Channel (J3F.3 R1F.1)
TACH7: FC11 (U4.13), U_Channel (J3G.3 R1G.1)
TACH8: FC11 (U4.12), U_Channel (J3H.3 R1H.1)